# EAGLE board LEDPanel (EAGLE 9.6.2), part 1 of 3
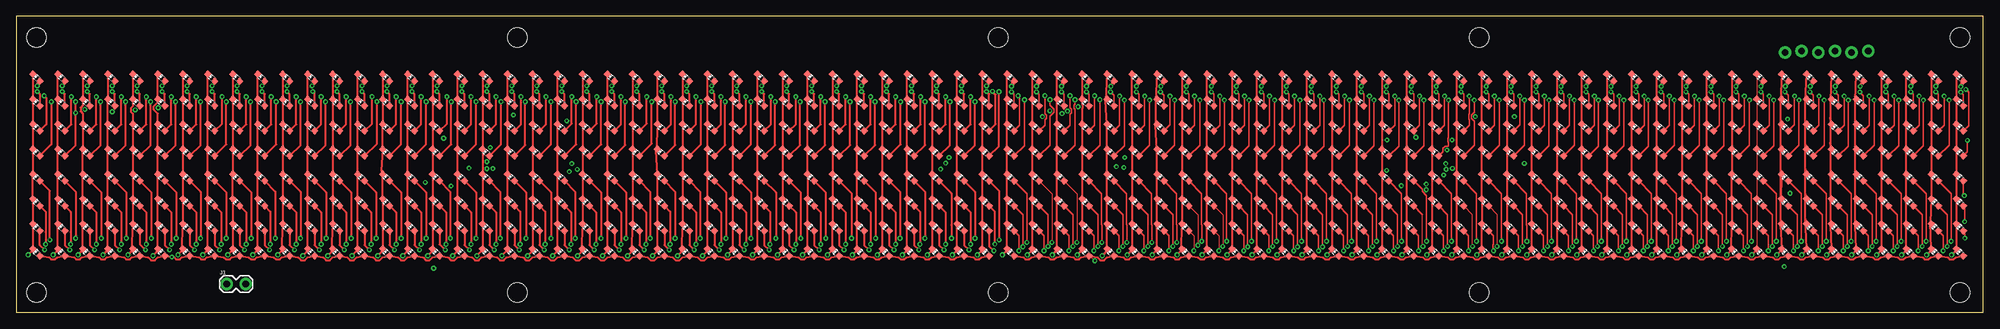
[diagram p2: board, top side]
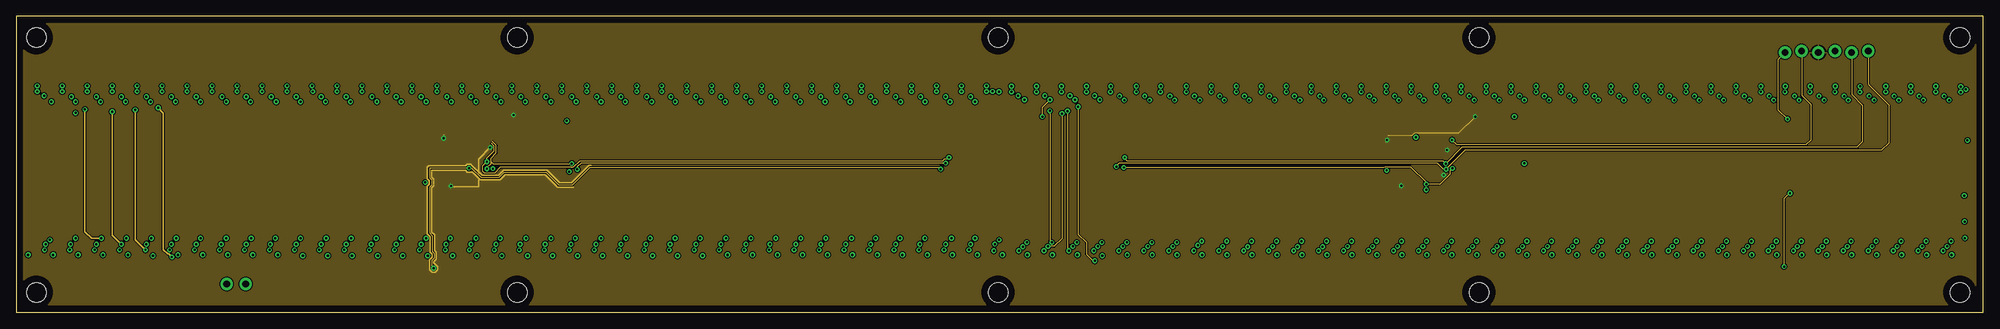
[diagram p3: board, inner layer Route2]
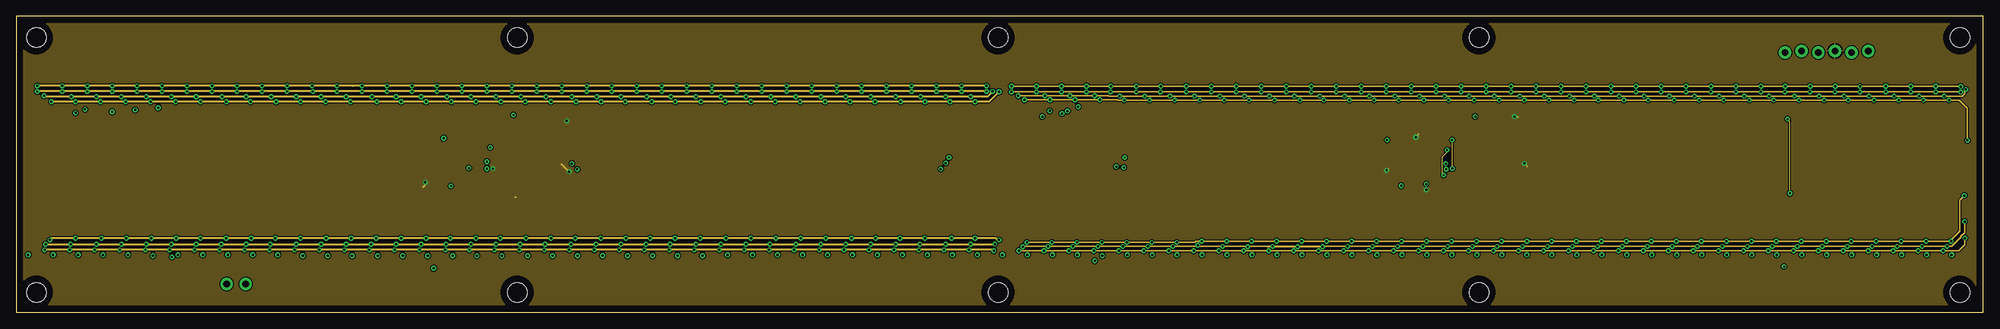
[diagram p4: board, inner layer Route15]
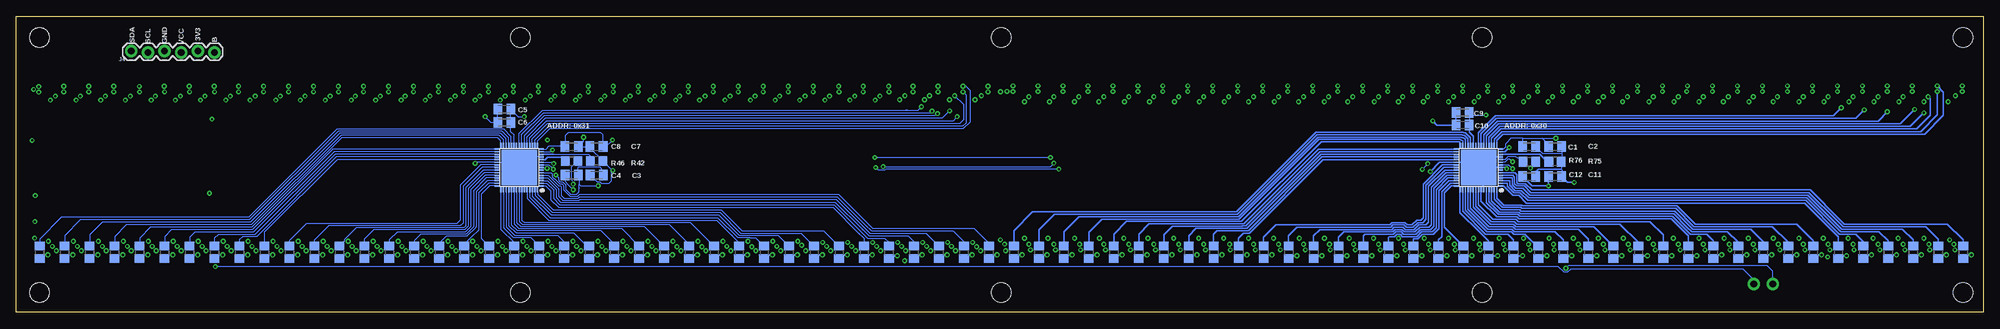
[diagram p5: board, bottom side, seen from below]

Size 299.95 x 45.14 mm. Coordinates in mm from the lower left corner, seen from the top.
Outline: 0,0 299.95,0 299.95,45.14 0,45.14 0,0
Copper layers (1*2+15*16): Top 0.035mm / dielectric 1.5mm / Route2 0.035mm / dielectric 0.15mm / Route15 0.035mm / dielectric 0.2mm / Bottom 0.035mm
Design rules "default *": minimum track width 6mil, minimum drill 0.3mm, track to track 6mil, track to pad 6mil, pad to pad 6mil, via to via 6mil, smd to smd 6mil, copper to edge 40mil, drill to drill 6mil, minimum pad ring 10mil, minimum via ring 8mil, stop-mask expansion 4mil, vias tented up to drill 20mil, thermal gap 10mil
Holes 3 mm at 3.05,41.91 3.05,3.05 296.42,3.05 296.42,41.91 149.73,41.91 149.73,3.05 76.39,3.05 76.39,41.91 223.08,41.91 223.08,3.05

## Footprints (pad centres in the part's own frame; a part is rotated, then mirrored left to right if it is on the bottom)
C0805K = smd 1.3 x 1.6: 1 -1,0; 2 1,0
1X02_LOCK = drill 1.016 pad 1.88: 1 -0.178,0; 2 2.718,0
1X06_LOCK = drill 1.016 pad 1.88: 1 0,0; 2 2.54,-0.254; 3 5.08,0; 4 7.62,-0.254; 5 10.16,0; 6 12.7,-0.254
CHIP-LED0603 = smd 0.8 x 0.8: A 0,-0.75; C 0,0.75
R0805 = smd 1.3 x 1.5: 1 -0.95,0; 2 0.95,0
QFN60 = smd 0.74 x 0.22: 1 -3.375,2.8; 2 -3.375,2.4; 3 -3.375,2; 4 -3.375,1.6; 5 -3.375,1.2; 6 -3.375,0.8; 7 -3.375,0.4; 8 -3.375,0; 9 -3.375,-0.4; 10 -3.375,-0.8; 11 -3.375,-1.2; 12 -3.375,-1.6; 13 -3.375,-2; 14 -3.375,-2.4; 15 -3.375,-2.8; 31 3.375,-2.8; 32 3.375,-2.4; 33 3.375,-2; 34 3.375,-1.6; 35 3.375,-1.2; 36 3.375,-0.8; 37 3.375,-0.4; 38 3.375,0; 39 3.375,0.4; 40 3.375,0.8; 41 3.375,1.2; 42 3.375,1.6; 43 3.375,2; 44 3.375,2.4; 45 3.375,2.8 | smd 0.22 x 0.74: 16 -2.8,-3.375; 17 -2.4,-3.375; 18 -2,-3.375; 19 -1.6,-3.375; 20 -1.2,-3.375; 21 -0.8,-3.375; 22 -0.4,-3.375; 23 0,-3.375; 24 0.4,-3.375; 25 0.8,-3.375; 26 1.2,-3.375; 27 1.6,-3.375; 28 2,-3.375; 29 2.4,-3.375; 30 2.8,-3.375; 46 2.8,3.375; 47 2.4,3.375; 48 2,3.375; 49 1.6,3.375; 50 1.2,3.375; 51 0.8,3.375; 52 0.4,3.375; 53 0,3.375; 54 -0.4,3.375; 55 -0.8,3.375; 56 -1.2,3.375; 57 -1.6,3.375; 58 -2,3.375; 59 -2.4,3.375; 60 -2.8,3.375 | smd 5.4 x 5.4: PAD 0,0

## Placement (x,y rotation side)
C1  0.1uF  [C0805K]  69.22,25.27 0 bottom
C2  1uF  [C0805K]  65.28,25.27 0 bottom
C3  0.1uF  [C0805K]  211.46,20.94 180 bottom
C4  1uF  [C0805K]  215.27,20.94 180 bottom
C5  0.1uF  [C0805K]  225.55,30.99 180 bottom
C6  1uF  [C0805K]  225.55,28.96 180 bottom
C7  0.1uF  [C0805K]  211.47,25.27 180 bottom
C8  1uF  [C0805K]  215.28,25.27 0 bottom
C9  0.1uF  [C0805K]  79.38,30.48 180 bottom
C10  1uF  [C0805K]  79.38,28.58 180 bottom
C11  0.1uF  [C0805K]  65.28,20.7 0 bottom
C12  1uF  [C0805K]  69.22,20.7 0 bottom
J1  [1X02_LOCK]  32.26,4.32 0 top
J4  [1X06_LOCK]  282.45,39.88 0 bottom
LED1  [CHIP-LED0603]  3.05,9.14 45 top
LED2  [CHIP-LED0603]  3.05,12.95 45 top
LED3  [CHIP-LED0603]  3.05,16.76 45 top
LED4  [CHIP-LED0603]  3.05,20.57 45 top
LED5  [CHIP-LED0603]  3.05,24.38 45 top
LED6  [CHIP-LED0603]  3.05,28.19 45 top
LED7  [CHIP-LED0603]  3.05,32 45 top
LED8  [CHIP-LED0603]  3.05,35.81 45 top
LED9  [CHIP-LED0603]  6.86,9.14 45 top
LED10  [CHIP-LED0603]  6.86,12.95 45 top
LED11  [CHIP-LED0603]  6.86,16.76 45 top
LED12  [CHIP-LED0603]  6.86,20.57 45 top
LED13  [CHIP-LED0603]  6.86,24.38 45 top
LED14  [CHIP-LED0603]  6.86,28.19 45 top
LED15  [CHIP-LED0603]  6.86,32 45 top
LED16  [CHIP-LED0603]  6.86,35.81 45 top
LED17  [CHIP-LED0603]  10.67,9.14 45 top
LED18  [CHIP-LED0603]  10.67,12.95 45 top
LED19  [CHIP-LED0603]  10.67,16.76 45 top
LED20  [CHIP-LED0603]  10.67,20.57 45 top
LED21  [CHIP-LED0603]  10.67,24.38 45 top
LED22  [CHIP-LED0603]  10.67,28.19 45 top
LED23  [CHIP-LED0603]  10.67,32 45 top
LED24  [CHIP-LED0603]  10.67,35.81 45 top
LED25  [CHIP-LED0603]  14.48,9.14 45 top
LED26  [CHIP-LED0603]  14.48,12.95 45 top
LED27  [CHIP-LED0603]  14.48,16.76 45 top
LED28  [CHIP-LED0603]  14.48,20.57 45 top
LED29  [CHIP-LED0603]  14.48,24.38 45 top
LED30  [CHIP-LED0603]  14.48,28.19 45 top
LED31  [CHIP-LED0603]  14.48,32 45 top
LED32  [CHIP-LED0603]  14.48,35.81 45 top
LED33  [CHIP-LED0603]  18.29,9.14 45 top
LED34  [CHIP-LED0603]  18.29,12.95 45 top
LED35  [CHIP-LED0603]  18.29,16.76 45 top
LED36  [CHIP-LED0603]  18.29,20.57 45 top
LED37  [CHIP-LED0603]  18.29,24.38 45 top
LED38  [CHIP-LED0603]  18.29,28.19 45 top
LED39  [CHIP-LED0603]  18.29,32 45 top
LED40  [CHIP-LED0603]  18.29,35.81 45 top
LED41  [CHIP-LED0603]  22.1,9.14 45 top
LED42  [CHIP-LED0603]  22.1,12.95 45 top
LED43  [CHIP-LED0603]  22.1,16.76 45 top
LED44  [CHIP-LED0603]  22.1,20.57 45 top
LED45  [CHIP-LED0603]  22.1,24.38 45 top
LED46  [CHIP-LED0603]  22.1,28.19 45 top
LED47  [CHIP-LED0603]  22.1,32 45 top
LED48  [CHIP-LED0603]  22.1,35.81 45 top
LED49  [CHIP-LED0603]  25.91,9.14 45 top
LED50  [CHIP-LED0603]  25.91,12.95 45 top
LED51  [CHIP-LED0603]  25.91,16.76 45 top
LED52  [CHIP-LED0603]  25.91,20.57 45 top
LED53  [CHIP-LED0603]  25.91,24.38 45 top
LED54  [CHIP-LED0603]  25.91,28.19 45 top
LED55  [CHIP-LED0603]  25.91,32 45 top
LED56  [CHIP-LED0603]  25.91,35.81 45 top
LED57  [CHIP-LED0603]  29.72,9.14 45 top
LED58  [CHIP-LED0603]  29.72,12.95 45 top
LED59  [CHIP-LED0603]  29.72,16.76 45 top
LED60  [CHIP-LED0603]  29.72,20.57 45 top
LED61  [CHIP-LED0603]  29.72,24.38 45 top
LED62  [CHIP-LED0603]  29.72,28.19 45 top
LED63  [CHIP-LED0603]  29.72,32 45 top
LED64  [CHIP-LED0603]  29.72,35.81 45 top
LED65  [CHIP-LED0603]  33.53,9.14 45 top
LED66  [CHIP-LED0603]  33.53,12.95 45 top
LED67  [CHIP-LED0603]  33.53,16.76 45 top
LED68  [CHIP-LED0603]  33.53,20.57 45 top
LED69  [CHIP-LED0603]  33.53,24.38 45 top
LED70  [CHIP-LED0603]  33.53,28.19 45 top
LED71  [CHIP-LED0603]  33.53,32 45 top
LED72  [CHIP-LED0603]  33.53,35.81 45 top
LED73  [CHIP-LED0603]  37.34,9.14 45 top
LED74  [CHIP-LED0603]  37.34,12.95 45 top
LED75  [CHIP-LED0603]  37.34,16.76 45 top
LED76  [CHIP-LED0603]  37.34,20.57 45 top
LED77  [CHIP-LED0603]  37.34,24.38 45 top
LED78  [CHIP-LED0603]  37.34,28.19 45 top
LED79  [CHIP-LED0603]  37.34,32 45 top
LED80  [CHIP-LED0603]  37.34,35.81 45 top
LED81  [CHIP-LED0603]  41.15,9.14 45 top
LED82  [CHIP-LED0603]  41.15,12.95 45 top
LED83  [CHIP-LED0603]  41.15,16.76 45 top
LED84  [CHIP-LED0603]  41.15,20.57 45 top
LED85  [CHIP-LED0603]  41.15,24.38 45 top
LED86  [CHIP-LED0603]  41.15,28.19 45 top
LED87  [CHIP-LED0603]  41.15,32 45 top
LED88  [CHIP-LED0603]  41.15,35.81 45 top
LED89  [CHIP-LED0603]  44.96,9.14 45 top
LED90  [CHIP-LED0603]  44.96,12.95 45 top
LED91  [CHIP-LED0603]  44.96,16.76 45 top
LED92  [CHIP-LED0603]  44.96,20.57 45 top
LED93  [CHIP-LED0603]  44.96,24.38 45 top
LED94  [CHIP-LED0603]  44.96,28.19 45 top
LED95  [CHIP-LED0603]  44.96,32 45 top
LED96  [CHIP-LED0603]  44.96,35.81 45 top
LED97  [CHIP-LED0603]  48.77,9.14 45 top
LED98  [CHIP-LED0603]  48.77,12.95 45 top
LED99  [CHIP-LED0603]  48.77,16.76 45 top
LED100  [CHIP-LED0603]  48.77,20.57 45 top
LED101  [CHIP-LED0603]  48.77,24.38 45 top
LED102  [CHIP-LED0603]  48.77,28.19 45 top
LED103  [CHIP-LED0603]  48.77,32 45 top
LED104  [CHIP-LED0603]  48.77,35.81 45 top
LED105  [CHIP-LED0603]  52.58,9.14 45 top
LED106  [CHIP-LED0603]  52.58,12.95 45 top
LED107  [CHIP-LED0603]  52.58,16.76 45 top
LED108  [CHIP-LED0603]  52.58,20.57 45 top
LED109  [CHIP-LED0603]  52.58,24.38 45 top
LED110  [CHIP-LED0603]  52.58,28.19 45 top
LED111  [CHIP-LED0603]  52.58,32 45 top
LED112  [CHIP-LED0603]  52.58,35.81 45 top
LED113  [CHIP-LED0603]  56.39,9.14 45 top
LED114  [CHIP-LED0603]  56.39,12.95 45 top
LED115  [CHIP-LED0603]  56.39,16.76 45 top
LED116  [CHIP-LED0603]  56.39,20.57 45 top
LED117  [CHIP-LED0603]  56.39,24.38 45 top
LED118  [CHIP-LED0603]  56.39,28.19 45 top
LED119  [CHIP-LED0603]  56.39,32 45 top
LED120  [CHIP-LED0603]  56.39,35.81 45 top
LED121  [CHIP-LED0603]  60.2,9.14 45 top
LED122  [CHIP-LED0603]  60.2,12.95 45 top
LED123  [CHIP-LED0603]  60.2,16.76 45 top
LED124  [CHIP-LED0603]  60.2,20.57 45 top
LED125  [CHIP-LED0603]  60.2,24.38 45 top
LED126  [CHIP-LED0603]  60.2,28.19 45 top
LED127  [CHIP-LED0603]  60.2,32 45 top
LED128  [CHIP-LED0603]  60.2,35.81 45 top
LED129  [CHIP-LED0603]  64.01,9.14 45 top
LED130  [CHIP-LED0603]  64.01,12.95 45 top
LED131  [CHIP-LED0603]  64.01,16.76 45 top
LED132  [CHIP-LED0603]  64.01,20.57 45 top
LED133  [CHIP-LED0603]  64.01,24.38 45 top
LED134  [CHIP-LED0603]  64.01,28.19 45 top
LED135  [CHIP-LED0603]  64.01,32 45 top
LED136  [CHIP-LED0603]  64.01,35.81 45 top
LED137  [CHIP-LED0603]  67.82,9.14 45 top
LED138  [CHIP-LED0603]  67.82,12.95 45 top
LED139  [CHIP-LED0603]  67.82,16.76 45 top
LED140  [CHIP-LED0603]  67.82,20.57 45 top
LED141  [CHIP-LED0603]  67.82,24.38 45 top
LED142  [CHIP-LED0603]  67.82,28.19 45 top
LED143  [CHIP-LED0603]  67.82,32 45 top
LED144  [CHIP-LED0603]  67.82,35.81 45 top
LED145  [CHIP-LED0603]  71.63,9.14 45 top
LED146  [CHIP-LED0603]  71.63,12.95 45 top
LED147  [CHIP-LED0603]  71.63,16.76 45 top
LED148  [CHIP-LED0603]  71.63,20.57 45 top
LED149  [CHIP-LED0603]  71.63,24.38 45 top
LED150  [CHIP-LED0603]  71.63,28.19 45 top
LED151  [CHIP-LED0603]  71.63,32 45 top
LED152  [CHIP-LED0603]  71.63,35.81 45 top
LED153  [CHIP-LED0603]  75.44,9.14 45 top
LED154  [CHIP-LED0603]  75.44,12.95 45 top
LED155  [CHIP-LED0603]  75.44,16.76 45 top
LED156  [CHIP-LED0603]  75.44,20.57 45 top
LED157  [CHIP-LED0603]  75.44,24.38 45 top
LED158  [CHIP-LED0603]  75.44,28.19 45 top
LED159  [CHIP-LED0603]  75.44,32 45 top
LED160  [CHIP-LED0603]  75.44,35.81 45 top
LED161  [CHIP-LED0603]  79.25,9.14 45 top
LED162  [CHIP-LED0603]  79.25,12.95 45 top
LED163  [CHIP-LED0603]  79.25,16.76 45 top
LED164  [CHIP-LED0603]  79.25,20.57 45 top
LED165  [CHIP-LED0603]  79.25,24.38 45 top
LED166  [CHIP-LED0603]  79.25,28.19 45 top
LED167  [CHIP-LED0603]  79.25,32 45 top
LED168  [CHIP-LED0603]  79.25,35.81 45 top
LED169  [CHIP-LED0603]  83.06,9.14 45 top
LED170  [CHIP-LED0603]  83.06,12.95 45 top
LED171  [CHIP-LED0603]  83.06,16.76 45 top
LED172  [CHIP-LED0603]  83.06,20.57 45 top
LED173  [CHIP-LED0603]  83.06,24.38 45 top
LED174  [CHIP-LED0603]  83.06,28.19 45 top
LED175  [CHIP-LED0603]  83.06,32 45 top
LED176  [CHIP-LED0603]  83.06,35.81 45 top
LED177  [CHIP-LED0603]  86.87,9.14 45 top
LED178  [CHIP-LED0603]  86.87,12.95 45 top
LED179  [CHIP-LED0603]  86.87,16.76 45 top
LED180  [CHIP-LED0603]  86.87,20.57 45 top
LED181  [CHIP-LED0603]  86.87,24.38 45 top
LED182  [CHIP-LED0603]  86.87,28.19 45 top
LED183  [CHIP-LED0603]  86.87,32 45 top
LED184  [CHIP-LED0603]  86.87,35.81 45 top
LED185  [CHIP-LED0603]  90.68,9.14 45 top
LED186  [CHIP-LED0603]  90.68,12.95 45 top
LED187  [CHIP-LED0603]  90.68,16.76 45 top
LED188  [CHIP-LED0603]  90.68,20.57 45 top
LED189  [CHIP-LED0603]  90.68,24.38 45 top
LED190  [CHIP-LED0603]  90.68,28.19 45 top
LED191  [CHIP-LED0603]  90.68,32 45 top
LED192  [CHIP-LED0603]  90.68,35.81 45 top
LED193  [CHIP-LED0603]  94.49,9.14 45 top
LED194  [CHIP-LED0603]  94.49,12.95 45 top
LED195  [CHIP-LED0603]  94.49,16.76 45 top
LED196  [CHIP-LED0603]  94.49,20.57 45 top
LED197  [CHIP-LED0603]  94.49,24.38 45 top
LED198  [CHIP-LED0603]  94.49,28.19 45 top
LED199  [CHIP-LED0603]  94.49,32 45 top
LED200  [CHIP-LED0603]  94.49,35.81 45 top
LED201  [CHIP-LED0603]  98.3,9.14 45 top
LED202  [CHIP-LED0603]  98.3,12.95 45 top
LED203  [CHIP-LED0603]  98.3,16.76 45 top
LED204  [CHIP-LED0603]  98.3,20.57 45 top
LED205  [CHIP-LED0603]  98.3,24.38 45 top
LED206  [CHIP-LED0603]  98.3,28.19 45 top
LED207  [CHIP-LED0603]  98.3,32 45 top
LED208  [CHIP-LED0603]  98.3,35.81 45 top
LED209  [CHIP-LED0603]  102.11,9.14 45 top
LED210  [CHIP-LED0603]  102.11,12.95 45 top
LED211  [CHIP-LED0603]  102.11,16.76 45 top
LED212  [CHIP-LED0603]  102.11,20.57 45 top
LED213  [CHIP-LED0603]  102.11,24.38 45 top
LED214  [CHIP-LED0603]  102.11,28.19 45 top
LED215  [CHIP-LED0603]  102.11,32 45 top
LED216  [CHIP-LED0603]  102.11,35.81 45 top
LED217  [CHIP-LED0603]  105.92,9.14 45 top
LED218  [CHIP-LED0603]  105.92,12.95 45 top
LED219  [CHIP-LED0603]  105.92,16.76 45 top
LED220  [CHIP-LED0603]  105.92,20.57 45 top
LED221  [CHIP-LED0603]  105.92,24.38 45 top
LED222  [CHIP-LED0603]  105.92,28.19 45 top
LED223  [CHIP-LED0603]  105.92,32 45 top
LED224  [CHIP-LED0603]  105.92,35.81 45 top
LED225  [CHIP-LED0603]  109.73,9.14 45 top
LED226  [CHIP-LED0603]  109.73,12.95 45 top
LED227  [CHIP-LED0603]  109.73,16.76 45 top
LED228  [CHIP-LED0603]  109.73,20.57 45 top
LED229  [CHIP-LED0603]  109.73,24.38 45 top
LED230  [CHIP-LED0603]  109.73,28.19 45 top
LED231  [CHIP-LED0603]  109.73,32 45 top
LED232  [CHIP-LED0603]  109.73,35.81 45 top
LED233  [CHIP-LED0603]  113.54,9.14 45 top
LED234  [CHIP-LED0603]  113.54,12.95 45 top
LED235  [CHIP-LED0603]  113.54,16.76 45 top
LED236  [CHIP-LED0603]  113.54,20.57 45 top
LED237  [CHIP-LED0603]  113.54,24.38 45 top
LED238  [CHIP-LED0603]  113.54,28.19 45 top
LED239  [CHIP-LED0603]  113.54,32 45 top
LED240  [CHIP-LED0603]  113.54,35.81 45 top
LED241  [CHIP-LED0603]  117.35,9.14 45 top
LED242  [CHIP-LED0603]  117.35,12.95 45 top
LED243  [CHIP-LED0603]  117.35,16.76 45 top
LED244  [CHIP-LED0603]  117.35,20.57 45 top
LED245  [CHIP-LED0603]  117.35,24.38 45 top
LED246  [CHIP-LED0603]  117.35,28.19 45 top
LED247  [CHIP-LED0603]  117.35,32 45 top
LED248  [CHIP-LED0603]  117.35,35.81 45 top
LED249  [CHIP-LED0603]  121.16,9.14 45 top
LED250  [CHIP-LED0603]  121.16,12.95 45 top
LED251  [CHIP-LED0603]  121.16,16.76 45 top
LED252  [CHIP-LED0603]  121.16,20.57 45 top
LED253  [CHIP-LED0603]  121.16,24.38 45 top
LED254  [CHIP-LED0603]  121.16,28.19 45 top
LED255  [CHIP-LED0603]  121.16,32 45 top
LED256  [CHIP-LED0603]  121.16,35.81 45 top
LED257  [CHIP-LED0603]  124.97,9.14 45 top
LED258  [CHIP-LED0603]  124.97,12.95 45 top
LED259  [CHIP-LED0603]  124.97,16.76 45 top
LED260  [CHIP-LED0603]  124.97,20.57 45 top
LED261  [CHIP-LED0603]  124.97,24.38 45 top
LED262  [CHIP-LED0603]  124.97,28.19 45 top
LED263  [CHIP-LED0603]  124.97,32 45 top
LED264  [CHIP-LED0603]  124.97,35.81 45 top
LED265  [CHIP-LED0603]  128.78,9.14 45 top
LED266  [CHIP-LED0603]  128.78,12.95 45 top
LED267  [CHIP-LED0603]  128.78,16.76 45 top
LED268  [CHIP-LED0603]  128.78,20.57 45 top
LED269  [CHIP-LED0603]  128.78,24.38 45 top
LED270  [CHIP-LED0603]  128.78,28.19 45 top
LED271  [CHIP-LED0603]  128.78,32 45 top
LED272  [CHIP-LED0603]  128.78,35.81 45 top
LED273  [CHIP-LED0603]  132.59,9.14 45 top
LED274  [CHIP-LED0603]  132.59,12.95 45 top
LED275  [CHIP-LED0603]  132.59,16.76 45 top
LED276  [CHIP-LED0603]  132.59,20.57 45 top
LED277  [CHIP-LED0603]  132.59,24.38 45 top
LED278  [CHIP-LED0603]  132.59,28.19 45 top
LED279  [CHIP-LED0603]  132.59,32 45 top
LED280  [CHIP-LED0603]  132.59,35.81 45 top
LED281  [CHIP-LED0603]  136.4,9.14 45 top
LED282  [CHIP-LED0603]  136.4,12.95 45 top
LED283  [CHIP-LED0603]  136.4,16.76 45 top
LED284  [CHIP-LED0603]  136.4,20.57 45 top
LED285  [CHIP-LED0603]  136.4,24.38 45 top
LED286  [CHIP-LED0603]  136.4,28.19 45 top
LED287  [CHIP-LED0603]  136.4,32 45 top
LED288  [CHIP-LED0603]  136.4,35.81 45 top
LED289  [CHIP-LED0603]  140.21,9.14 45 top
LED290  [CHIP-LED0603]  140.21,12.95 45 top
LED291  [CHIP-LED0603]  140.21,16.76 45 top
LED292  [CHIP-LED0603]  140.21,20.57 45 top
LED293  [CHIP-LED0603]  140.21,24.38 45 top
LED294  [CHIP-LED0603]  140.21,28.19 45 top
LED295  [CHIP-LED0603]  140.21,32 45 top
LED296  [CHIP-LED0603]  140.21,35.81 45 top
LED297  [CHIP-LED0603]  144.02,9.14 45 top
LED298  [CHIP-LED0603]  144.02,12.95 45 top
LED299  [CHIP-LED0603]  144.02,16.76 45 top
LED300  [CHIP-LED0603]  144.02,20.57 45 top
LED301  [CHIP-LED0603]  144.02,24.38 45 top
LED302  [CHIP-LED0603]  144.02,28.19 45 top
LED303  [CHIP-LED0603]  144.02,32 45 top
LED304  [CHIP-LED0603]  144.02,35.81 45 top
LED305  [CHIP-LED0603]  147.83,9.14 45 top
LED306  [CHIP-LED0603]  147.83,12.95 45 top
LED307  [CHIP-LED0603]  147.83,16.76 45 top
LED308  [CHIP-LED0603]  147.83,20.57 45 top
LED309  [CHIP-LED0603]  147.83,24.38 45 top
LED310  [CHIP-LED0603]  147.83,28.19 45 top
LED311  [CHIP-LED0603]  147.83,32 45 top
LED312  [CHIP-LED0603]  147.83,35.81 45 top
LED313  [CHIP-LED0603]  151.64,9.14 45 top
LED314  [CHIP-LED0603]  151.64,12.95 45 top
LED315  [CHIP-LED0603]  151.64,16.76 45 top
LED316  [CHIP-LED0603]  151.64,20.57 45 top
LED317  [CHIP-LED0603]  151.64,24.38 45 top
LED318  [CHIP-LED0603]  151.64,28.19 45 top
LED319  [CHIP-LED0603]  151.64,32 45 top
LED320  [CHIP-LED0603]  151.64,35.81 45 top
LED321  [CHIP-LED0603]  155.45,9.14 45 top
LED322  [CHIP-LED0603]  155.45,12.95 45 top
LED323  [CHIP-LED0603]  155.45,16.76 45 top
LED324  [CHIP-LED0603]  155.45,20.57 45 top
LED325  [CHIP-LED0603]  155.45,24.38 45 top
LED326  [CHIP-LED0603]  155.45,28.19 45 top
LED327  [CHIP-LED0603]  155.45,32 45 top
LED328  [CHIP-LED0603]  155.45,35.81 45 top
LED329  [CHIP-LED0603]  159.26,9.14 45 top
LED330  [CHIP-LED0603]  159.26,12.95 45 top
LED331  [CHIP-LED0603]  159.26,16.76 45 top
LED332  [CHIP-LED0603]  159.26,20.57 45 top
LED333  [CHIP-LED0603]  159.26,24.38 45 top
LED334  [CHIP-LED0603]  159.26,28.19 45 top
LED335  [CHIP-LED0603]  159.26,32 45 top
LED336  [CHIP-LED0603]  159.26,35.81 45 top
LED337  [CHIP-LED0603]  163.07,9.14 45 top
LED338  [CHIP-LED0603]  163.07,12.95 45 top
LED339  [CHIP-LED0603]  163.07,16.76 45 top
LED340  [CHIP-LED0603]  163.07,20.57 45 top
LED341  [CHIP-LED0603]  163.07,24.38 45 top
LED342  [CHIP-LED0603]  163.07,28.19 45 top
LED343  [CHIP-LED0603]  163.07,32 45 top
LED344  [CHIP-LED0603]  163.07,35.81 45 top
LED345  [CHIP-LED0603]  166.88,9.14 45 top
LED346  [CHIP-LED0603]  166.88,12.95 45 top
LED347  [CHIP-LED0603]  166.88,16.76 45 top
LED348  [CHIP-LED0603]  166.88,20.57 45 top
LED349  [CHIP-LED0603]  166.88,24.38 45 top
LED350  [CHIP-LED0603]  166.88,28.19 45 top
LED351  [CHIP-LED0603]  166.88,32 45 top
LED352  [CHIP-LED0603]  166.88,35.81 45 top
LED353  [CHIP-LED0603]  170.69,9.14 45 top
LED354  [CHIP-LED0603]  170.69,12.95 45 top
LED355  [CHIP-LED0603]  170.69,16.76 45 top
LED356  [CHIP-LED0603]  170.69,20.57 45 top
LED357  [CHIP-LED0603]  170.69,24.38 45 top
LED358  [CHIP-LED0603]  170.69,28.19 45 top
LED359  [CHIP-LED0603]  170.69,32 45 top
LED360  [CHIP-LED0603]  170.69,35.81 45 top
LED361  [CHIP-LED0603]  174.5,9.14 45 top
LED362  [CHIP-LED0603]  174.5,12.95 45 top
LED363  [CHIP-LED0603]  174.5,16.76 45 top
LED364  [CHIP-LED0603]  174.5,20.57 45 top
LED365  [CHIP-LED0603]  174.5,24.38 45 top
LED366  [CHIP-LED0603]  174.5,28.19 45 top
LED367  [CHIP-LED0603]  174.5,32 45 top
LED368  [CHIP-LED0603]  174.5,35.81 45 top
LED369  [CHIP-LED0603]  178.31,9.14 45 top
LED370  [CHIP-LED0603]  178.31,12.95 45 top
LED371  [CHIP-LED0603]  178.31,16.76 45 top
LED372  [CHIP-LED0603]  178.31,20.57 45 top
LED373  [CHIP-LED0603]  178.31,24.38 45 top
LED374  [CHIP-LED0603]  178.31,28.19 45 top
LED375  [CHIP-LED0603]  178.31,32 45 top
LED376  [CHIP-LED0603]  178.31,35.81 45 top
LED377  [CHIP-LED0603]  182.12,9.14 45 top
LED378  [CHIP-LED0603]  182.12,12.95 45 top
LED379  [CHIP-LED0603]  182.12,16.76 45 top
LED380  [CHIP-LED0603]  182.12,20.57 45 top
LED381  [CHIP-LED0603]  182.12,24.38 45 top
LED382  [CHIP-LED0603]  182.12,28.19 45 top
LED383  [CHIP-LED0603]  182.12,32 45 top
LED384  [CHIP-LED0603]  182.12,35.81 45 top
LED385  [CHIP-LED0603]  185.93,9.14 45 top
LED386  [CHIP-LED0603]  185.93,12.95 45 top
LED387  [CHIP-LED0603]  185.93,16.76 45 top
LED388  [CHIP-LED0603]  185.93,20.57 45 top
LED389  [CHIP-LED0603]  185.93,24.38 45 top
LED390  [CHIP-LED0603]  185.93,28.19 45 top
LED391  [CHIP-LED0603]  185.93,32 45 top
LED392  [CHIP-LED0603]  185.93,35.81 45 top
LED393  [CHIP-LED0603]  189.74,9.14 45 top
LED394  [CHIP-LED0603]  189.74,12.95 45 top
LED395  [CHIP-LED0603]  189.74,16.76 45 top
LED396  [CHIP-LED0603]  189.74,20.57 45 top
LED397  [CHIP-LED0603]  189.74,24.38 45 top
LED398  [CHIP-LED0603]  189.74,28.19 45 top
LED399  [CHIP-LED0603]  189.74,32 45 top
LED400  [CHIP-LED0603]  189.74,35.81 45 top
LED401  [CHIP-LED0603]  193.55,9.14 45 top
LED402  [CHIP-LED0603]  193.55,12.95 45 top
LED403  [CHIP-LED0603]  193.55,16.76 45 top
LED404  [CHIP-LED0603]  193.55,20.57 45 top
LED405  [CHIP-LED0603]  193.55,24.38 45 top
LED406  [CHIP-LED0603]  193.55,28.19 45 top
LED407  [CHIP-LED0603]  193.55,32 45 top
LED408  [CHIP-LED0603]  193.55,35.81 45 top
LED409  [CHIP-LED0603]  197.36,9.14 45 top
LED410  [CHIP-LED0603]  197.36,12.95 45 top
LED411  [CHIP-LED0603]  197.36,16.76 45 top
LED412  [CHIP-LED0603]  197.36,20.57 45 top
LED413  [CHIP-LED0603]  197.36,24.38 45 top
LED414  [CHIP-LED0603]  197.36,28.19 45 top
LED415  [CHIP-LED0603]  197.36,32 45 top
LED416  [CHIP-LED0603]  197.36,35.81 45 top
LED417  [CHIP-LED0603]  201.17,9.14 45 top
LED418  [CHIP-LED0603]  201.17,12.95 45 top
LED419  [CHIP-LED0603]  201.17,16.76 45 top
LED420  [CHIP-LED0603]  201.17,20.57 45 top
LED421  [CHIP-LED0603]  201.17,24.38 45 top
LED422  [CHIP-LED0603]  201.17,28.19 45 top
LED423  [CHIP-LED0603]  201.17,32 45 top
LED424  [CHIP-LED0603]  201.17,35.81 45 top
LED425  [CHIP-LED0603]  204.98,9.14 45 top
LED426  [CHIP-LED0603]  204.98,12.95 45 top
LED427  [CHIP-LED0603]  204.98,16.76 45 top
LED428  [CHIP-LED0603]  204.98,20.57 45 top
LED429  [CHIP-LED0603]  204.98,24.38 45 top
LED430  [CHIP-LED0603]  204.98,28.19 45 top
LED431  [CHIP-LED0603]  204.98,32 45 top
LED432  [CHIP-LED0603]  204.98,35.81 45 top
LED433  [CHIP-LED0603]  208.79,9.14 45 top
LED434  [CHIP-LED0603]  208.79,12.95 45 top
LED435  [CHIP-LED0603]  208.79,16.76 45 top
LED436  [CHIP-LED0603]  208.79,20.57 45 top
LED437  [CHIP-LED0603]  208.79,24.38 45 top
LED438  [CHIP-LED0603]  208.79,28.19 45 top
LED439  [CHIP-LED0603]  208.79,32 45 top
LED440  [CHIP-LED0603]  208.79,35.81 45 top
LED441  [CHIP-LED0603]  212.6,9.14 45 top
LED442  [CHIP-LED0603]  212.6,12.95 45 top
LED443  [CHIP-LED0603]  212.6,16.76 45 top
LED444  [CHIP-LED0603]  212.6,20.57 45 top
LED445  [CHIP-LED0603]  212.6,24.38 45 top
LED446  [CHIP-LED0603]  212.6,28.19 45 top
LED447  [CHIP-LED0603]  212.6,32 45 top
LED448  [CHIP-LED0603]  212.6,35.81 45 top
LED449  [CHIP-LED0603]  216.41,9.14 45 top
LED450  [CHIP-LED0603]  216.41,12.95 45 top
LED451  [CHIP-LED0603]  216.41,16.76 45 top
LED452  [CHIP-LED0603]  216.41,20.57 45 top
LED453  [CHIP-LED0603]  216.41,24.38 45 top
LED454  [CHIP-LED0603]  216.41,28.19 45 top
LED455  [CHIP-LED0603]  216.41,32 45 top
LED456  [CHIP-LED0603]  216.41,35.81 45 top
LED457  [CHIP-LED0603]  220.22,9.14 45 top
LED458  [CHIP-LED0603]  220.22,12.95 45 top
LED459  [CHIP-LED0603]  220.22,16.76 45 top
LED460  [CHIP-LED0603]  220.22,20.57 45 top
LED461  [CHIP-LED0603]  220.22,24.38 45 top
LED462  [CHIP-LED0603]  220.22,28.19 45 top
LED463  [CHIP-LED0603]  220.22,32 45 top
LED464  [CHIP-LED0603]  220.22,35.81 45 top
LED465  [CHIP-LED0603]  224.03,9.14 45 top
LED466  [CHIP-LED0603]  224.03,12.95 45 top
LED467  [CHIP-LED0603]  224.03,16.76 45 top
LED468  [CHIP-LED0603]  224.03,20.57 45 top
LED469  [CHIP-LED0603]  224.03,24.38 45 top
LED470  [CHIP-LED0603]  224.03,28.19 45 top
LED471  [CHIP-LED0603]  224.03,32 45 top
LED472  [CHIP-LED0603]  224.03,35.81 45 top
LED473  [CHIP-LED0603]  227.84,9.14 45 top
LED474  [CHIP-LED0603]  227.84,12.95 45 top
LED475  [CHIP-LED0603]  227.84,16.76 45 top
LED476  [CHIP-LED0603]  227.84,20.57 45 top
LED477  [CHIP-LED0603]  227.84,24.38 45 top
LED478  [CHIP-LED0603]  227.84,28.19 45 top
LED479  [CHIP-LED0603]  227.84,32 45 top
LED480  [CHIP-LED0603]  227.84,35.81 45 top
LED481  [CHIP-LED0603]  231.65,9.14 45 top
LED482  [CHIP-LED0603]  231.65,12.95 45 top
LED483  [CHIP-LED0603]  231.65,16.76 45 top
LED484  [CHIP-LED0603]  231.65,20.57 45 top
LED485  [CHIP-LED0603]  231.65,24.38 45 top
LED486  [CHIP-LED0603]  231.65,28.19 45 top
LED487  [CHIP-LED0603]  231.65,32 45 top
LED488  [CHIP-LED0603]  231.65,35.81 45 top
LED489  [CHIP-LED0603]  235.46,9.14 45 top
LED490  [CHIP-LED0603]  235.46,12.95 45 top
LED491  [CHIP-LED0603]  235.46,16.76 45 top
LED492  [CHIP-LED0603]  235.46,20.57 45 top
LED493  [CHIP-LED0603]  235.46,24.38 45 top
LED494  [CHIP-LED0603]  235.46,28.19 45 top
LED495  [CHIP-LED0603]  235.46,32 45 top
LED496  [CHIP-LED0603]  235.46,35.81 45 top
LED497  [CHIP-LED0603]  239.27,9.14 45 top
LED498  [CHIP-LED0603]  239.27,12.95 45 top
LED499  [CHIP-LED0603]  239.27,16.76 45 top
LED500  [CHIP-LED0603]  239.27,20.57 45 top
LED501  [CHIP-LED0603]  239.27,24.38 45 top
LED502  [CHIP-LED0603]  239.27,28.19 45 top
LED503  [CHIP-LED0603]  239.27,32 45 top
LED504  [CHIP-LED0603]  239.27,35.81 45 top
LED505  [CHIP-LED0603]  243.08,9.14 45 top
LED506  [CHIP-LED0603]  243.08,12.95 45 top
LED507  [CHIP-LED0603]  243.08,16.76 45 top
LED508  [CHIP-LED0603]  243.08,20.57 45 top
LED509  [CHIP-LED0603]  243.08,24.38 45 top
LED510  [CHIP-LED0603]  243.08,28.19 45 top
LED511  [CHIP-LED0603]  243.08,32 45 top
LED512  [CHIP-LED0603]  243.08,35.81 45 top
LED513  [CHIP-LED0603]  246.89,9.14 45 top
LED514  [CHIP-LED0603]  246.89,12.95 45 top
LED515  [CHIP-LED0603]  246.89,16.76 45 top
LED516  [CHIP-LED0603]  246.89,20.57 45 top
LED517  [CHIP-LED0603]  246.89,24.38 45 top
LED518  [CHIP-LED0603]  246.89,28.19 45 top
LED519  [CHIP-LED0603]  246.89,32 45 top
LED520  [CHIP-LED0603]  246.89,35.81 45 top
LED521  [CHIP-LED0603]  250.7,9.14 45 top
LED522  [CHIP-LED0603]  250.7,12.95 45 top
LED523  [CHIP-LED0603]  250.7,16.76 45 top
LED524  [CHIP-LED0603]  250.7,20.57 45 top
LED525  [CHIP-LED0603]  250.7,24.38 45 top
LED526  [CHIP-LED0603]  250.7,28.19 45 top
LED527  [CHIP-LED0603]  250.7,32 45 top
LED528  [CHIP-LED0603]  250.7,35.81 45 top
LED529  [CHIP-LED0603]  254.51,9.14 45 top
LED530  [CHIP-LED0603]  254.51,12.95 45 top
LED531  [CHIP-LED0603]  254.51,16.76 45 top
LED532  [CHIP-LED0603]  254.51,20.57 45 top
LED533  [CHIP-LED0603]  254.51,24.38 45 top
LED534  [CHIP-LED0603]  254.51,28.19 45 top
LED535  [CHIP-LED0603]  254.51,32 45 top
LED536  [CHIP-LED0603]  254.51,35.81 45 top
LED537  [CHIP-LED0603]  258.32,9.14 45 top
LED538  [CHIP-LED0603]  258.32,12.95 45 top
LED539  [CHIP-LED0603]  258.32,16.76 45 top
LED540  [CHIP-LED0603]  258.32,20.57 45 top
LED541  [CHIP-LED0603]  258.32,24.38 45 top
LED542  [CHIP-LED0603]  258.32,28.19 45 top
LED543  [CHIP-LED0603]  258.32,32 45 top
LED544  [CHIP-LED0603]  258.32,35.81 45 top
LED545  [CHIP-LED0603]  262.13,9.14 45 top
LED546  [CHIP-LED0603]  262.13,12.95 45 top
LED547  [CHIP-LED0603]  262.13,16.76 45 top
LED548  [CHIP-LED0603]  262.13,20.57 45 top
LED549  [CHIP-LED0603]  262.13,24.38 45 top
LED550  [CHIP-LED0603]  262.13,28.19 45 top
LED551  [CHIP-LED0603]  262.13,32 45 top
LED552  [CHIP-LED0603]  262.13,35.81 45 top
LED553  [CHIP-LED0603]  265.94,9.14 45 top
LED554  [CHIP-LED0603]  265.94,12.95 45 top
LED555  [CHIP-LED0603]  265.94,16.76 45 top
LED556  [CHIP-LED0603]  265.94,20.57 45 top
LED557  [CHIP-LED0603]  265.94,24.38 45 top
LED558  [CHIP-LED0603]  265.94,28.19 45 top
LED559  [CHIP-LED0603]  265.94,32 45 top
LED560  [CHIP-LED0603]  265.94,35.81 45 top
LED561  [CHIP-LED0603]  269.75,9.14 45 top
LED562  [CHIP-LED0603]  269.75,12.95 45 top
LED563  [CHIP-LED0603]  269.75,16.76 45 top
LED564  [CHIP-LED0603]  269.75,20.57 45 top
LED565  [CHIP-LED0603]  269.75,24.38 45 top
LED566  [CHIP-LED0603]  269.75,28.19 45 top
LED567  [CHIP-LED0603]  269.75,32 45 top
LED568  [CHIP-LED0603]  269.75,35.81 45 top
LED569  [CHIP-LED0603]  273.56,9.14 45 top
LED570  [CHIP-LED0603]  273.56,12.95 45 top
LED571  [CHIP-LED0603]  273.56,16.76 45 top
LED572  [CHIP-LED0603]  273.56,20.57 45 top
LED573  [CHIP-LED0603]  273.56,24.38 45 top
LED574  [CHIP-LED0603]  273.56,28.19 45 top
LED575  [CHIP-LED0603]  273.56,32 45 top
LED576  [CHIP-LED0603]  273.56,35.81 45 top
LED577  [CHIP-LED0603]  277.37,9.14 45 top
LED578  [CHIP-LED0603]  277.37,12.95 45 top
LED579  [CHIP-LED0603]  277.37,16.76 45 top
LED580  [CHIP-LED0603]  277.37,20.57 45 top
LED581  [CHIP-LED0603]  277.37,24.38 45 top
LED582  [CHIP-LED0603]  277.37,28.19 45 top
LED583  [CHIP-LED0603]  277.37,32 45 top
LED584  [CHIP-LED0603]  277.37,35.81 45 top
LED585  [CHIP-LED0603]  281.18,9.14 45 top
LED586  [CHIP-LED0603]  281.18,12.95 45 top
LED587  [CHIP-LED0603]  281.18,16.76 45 top
LED588  [CHIP-LED0603]  281.18,20.57 45 top
LED589  [CHIP-LED0603]  281.18,24.38 45 top
LED590  [CHIP-LED0603]  281.18,28.19 45 top
LED591  [CHIP-LED0603]  281.18,32 45 top
LED592  [CHIP-LED0603]  281.18,35.81 45 top
LED593  [CHIP-LED0603]  284.99,9.14 45 top
LED594  [CHIP-LED0603]  284.99,12.95 45 top
LED595  [CHIP-LED0603]  284.99,16.76 45 top
LED596  [CHIP-LED0603]  284.99,20.57 45 top
LED597  [CHIP-LED0603]  284.99,24.38 45 top
LED598  [CHIP-LED0603]  284.99,28.19 45 top
LED599  [CHIP-LED0603]  284.99,32 45 top
LED600  [CHIP-LED0603]  284.99,35.81 45 top
LED601  [CHIP-LED0603]  288.8,9.14 45 top
LED602  [CHIP-LED0603]  288.8,12.95 45 top
LED603  [CHIP-LED0603]  288.8,16.76 45 top
LED604  [CHIP-LED0603]  288.8,20.57 45 top
LED605  [CHIP-LED0603]  288.8,24.38 45 top
LED606  [CHIP-LED0603]  288.8,28.19 45 top
LED607  [CHIP-LED0603]  288.8,32 45 top
LED608  [CHIP-LED0603]  288.8,35.81 45 top
LED609  [CHIP-LED0603]  292.61,9.14 45 top
LED610  [CHIP-LED0603]  292.61,12.95 45 top
LED611  [CHIP-LED0603]  292.61,16.76 45 top
LED612  [CHIP-LED0603]  292.61,20.57 45 top
LED613  [CHIP-LED0603]  292.61,24.38 45 top
LED614  [CHIP-LED0603]  292.61,28.19 45 top
LED615  [CHIP-LED0603]  292.61,32 45 top
LED616  [CHIP-LED0603]  292.61,35.81 45 top
LED617  [CHIP-LED0603]  296.42,9.14 45 top
LED618  [CHIP-LED0603]  296.42,12.95 45 top
LED619  [CHIP-LED0603]  296.42,16.76 45 top
LED620  [CHIP-LED0603]  296.42,20.57 45 top
LED621  [CHIP-LED0603]  296.42,24.38 45 top
LED622  [CHIP-LED0603]  296.42,28.19 45 top
LED623  [CHIP-LED0603]  296.42,32 45 top
LED624  [CHIP-LED0603]  296.42,35.81 45 top
R1  68  [R0805]  292.61,9.14 270 bottom
R2  68  [R0805]  288.8,9.14 270 bottom
R3  68  [R0805]  284.99,9.14 270 bottom
R4  68  [R0805]  163.07,9.14 270 bottom
R5  68  [R0805]  166.88,9.14 270 bottom
R6  68  [R0805]  170.69,9.14 270 bottom
R7  68  [R0805]  174.5,9.14 270 bottom
R8  68  [R0805]  178.31,9.14 270 bottom
R9  68  [R0805]  182.12,9.14 270 bottom
R10  68  [R0805]  185.93,9.14 270 bottom
R11  68  [R0805]  189.74,9.14 270 bottom
R12  68  [R0805]  193.55,9.14 270 bottom
R13  68  [R0805]  197.36,9.14 270 bottom
R14  68  [R0805]  201.17,9.14 270 bottom
R15  68  [R0805]  204.98,9.14 270 bottom
R16  68  [R0805]  208.79,9.14 270 bottom
R17  68  [R0805]  212.6,9.14 270 bottom
R18  68  [R0805]  216.41,9.14 270 bottom
R19  68  [R0805]  220.22,9.14 270 bottom
R20  68  [R0805]  224.03,9.14 270 bottom
R21  68  [R0805]  227.84,9.14 270 bottom
R22  68  [R0805]  296.42,9.14 270 bottom
R23  68  [R0805]  281.18,9.14 270 bottom
R24  68  [R0805]  277.37,9.14 270 bottom
R25  68  [R0805]  273.56,9.14 270 bottom
R26  68  [R0805]  269.75,9.14 270 bottom
R27  68  [R0805]  265.94,9.14 270 bottom
R28  68  [R0805]  262.13,9.14 270 bottom
R29  68  [R0805]  258.32,9.14 270 bottom
R30  68  [R0805]  254.51,9.14 270 bottom
R31  68  [R0805]  250.7,9.14 270 bottom
R32  68  [R0805]  246.89,9.14 270 bottom
R33  68  [R0805]  243.08,9.14 270 bottom
R34  68  [R0805]  239.27,9.14 270 bottom
R35  68  [R0805]  235.46,9.14 270 bottom
R36  68  [R0805]  231.65,9.14 270 bottom
R37  68  [R0805]  14.48,9.14 270 bottom
R38  68  [R0805]  18.29,9.14 270 bottom
R39  68  [R0805]  22.1,9.14 270 bottom
R40  68  [R0805]  25.91,9.14 270 bottom
R41  68  [R0805]  29.72,9.14 270 bottom
R42  10k  [R0805]  211.46,23.1 180 bottom
R43  68  [R0805]  33.53,9.14 270 bottom
R44  68  [R0805]  37.34,9.14 270 bottom
R45  68  [R0805]  41.15,9.14 270 bottom
R46  10k  [R0805]  215.27,23.1 0 bottom
R47  68  [R0805]  44.96,9.14 270 bottom
R48  68  [R0805]  48.77,9.14 270 bottom
R49  68  [R0805]  52.58,9.14 270 bottom
R50  68  [R0805]  56.39,9.14 270 bottom
R51  68  [R0805]  60.2,9.14 270 bottom
R52  68  [R0805]  64.01,9.14 270 bottom
R53  68  [R0805]  67.82,9.14 270 bottom
R54  68  [R0805]  71.63,9.14 270 bottom
R55  68  [R0805]  75.44,9.14 270 bottom
R56  68  [R0805]  79.25,9.14 270 bottom
R57  68  [R0805]  147.83,9.14 270 bottom
R58  68  [R0805]  144.02,9.14 270 bottom
R59  68  [R0805]  140.21,9.14 270 bottom
R60  68  [R0805]  136.4,9.14 270 bottom
R61  68  [R0805]  132.59,9.14 270 bottom
R62  68  [R0805]  128.78,9.14 270 bottom
R63  68  [R0805]  124.97,9.14 270 bottom
R64  68  [R0805]  121.16,9.14 270 bottom
R65  68  [R0805]  117.35,9.14 270 bottom
R66  68  [R0805]  113.54,9.14 270 bottom
R67  68  [R0805]  109.73,9.14 270 bottom
R68  68  [R0805]  105.92,9.14 270 bottom
R69  68  [R0805]  102.11,9.14 270 bottom
R70  68  [R0805]  98.3,9.14 270 bottom
R71  68  [R0805]  94.49,9.14 270 bottom
R72  68  [R0805]  90.68,9.14 270 bottom
R73  68  [R0805]  86.87,9.14 270 bottom
R74  68  [R0805]  83.06,9.14 270 bottom
R75  10k  [R0805]  65.28,22.99 180 bottom
R76  10k  [R0805]  69.22,22.99 0 bottom
R77  68  [R0805]  151.64,9.14 270 bottom
R78  68  [R0805]  155.45,9.14 270 bottom
R79  68  [R0805]  159.26,9.14 270 bottom
R80  68  [R0805]  3.05,9.14 270 bottom
R81  68  [R0805]  6.86,9.14 270 bottom
R82  68  [R0805]  10.67,9.14 270 bottom
U1  IS31FL3741_QFN60  [QFN60]  223.27,22.1 180 bottom
U2  IS31FL3741_QFN60  [QFN60]  76.96,22.1 180 bottom

## Tracks (layer width: path | path; a pad name or v marks a point on that pad's centre or on a via)
3V3  (via drill 0.3)
  Route2 0.152: v219.02,21.97 218.64,21.6 218.64,21.09 217.1,19.56 v215.01,19.56 215.01,19.81 212.58,22.24 208.74,22.24 208.6,22.1 v168.91,22.1 | v140.97,21.84 140.72,22.1 87.5,22.1 84.84,19.43 82.68,19.43 80.77,21.34 74.42,21.34 73.66,20.57 70.87,20.57 69.43,22.01 v69.03,22.01 63.03,22.01 62.99,21.97 62.99,20.5 63.29,20.2 63.29,19.42 62.99,19.12 62.99,12.12 63.42,11.69 63.42,9.31 63.7,9.04 63.7,8.24 63.34,7.88 63.34,7.01 v63.63,6.73 63.75,6.6 63.82,6.67 63.75,6.73 | J4.5 272.29,33.15 273.69,31.75 273.69,26.29 272.92,25.53 219.71,25.53 v218.95,26.29
  Route15 0.152: v218.95,26.29 218.95,22.04 v219.02,21.97
  Bottom 0.152: R76.2 68.27,22.77 v69.03,22.01 | U1.8 219.83,22.04 219.43,22.04 219.36,21.97 v219.02,21.97 | v215.01,19.56 215.01,19.91 215.14,20.05 | 215.14,20.07 215.14,20.05 | 215.14,20.05 215.27,20.17 215.27,22.21 214.38,23.1 | v140.97,21.84 167.32,21.84 167.53,21.64 168.46,21.64 v168.91,22.1 | J1.1 32.08,6.3 32.89,7.11 63.25,7.11 v63.63,6.73
  Bottom 0.203: 214.77,23.1 214.38,23.1 R46.2
BUTTON  (via drill 0.3)
  Route2 0.152: v269.62,6.98 269.62,17.4 270.38,18.16 v270.51,18.16 | v270.13,29.46 268.73,30.86 268.73,38.61 J4.6
  Route15 0.152: v270.51,18.16 270.51,29.08 v270.13,29.46
  Bottom 0.152: J1.2 34.98,5 36.58,6.6 62.87,6.6 63.37,6.1 63.88,6.1 64.77,6.98 v269.62,6.98
GND  (via drill 0.3)
  Route15 0.152: v228.47,29.84 228.98,29.84 229.11,29.72 | v213.45,26.71 213.45,26.76 213.87,27.18 213.8,27.24 213.36,26.8 | v230,22.73 230.38,22.35 230.38,22.1 | v208.98,21.66 209.3,21.97 | v215.01,18.7 215.01,18.41 215.14,18.29
  Route15 0.203: 76.2,17.53 76.07,17.53 76.07,17.65 | v84.33,21.47 83.19,22.61 83.06,22.61 | v62.36,19.81 62.36,19.36 62.05,19.05
  Bottom 0.152: C1.2 67.19,24.24 64.27,24.24 64.26,24.26 | 64.26,24.26 64.26,25.26 C2.2 | 64.26,24.26 64.26,23.05 R75.1 | C5.2 C6.2 227.58,28.96 v228.47,29.84 | v213.45,26.71 213.45,26.1 C8.2 C7.2 212.47,25.06 R42.1 209.06,21.66 v208.98,21.66 209.23,21.41 209.23,20 | U1.12 222.43,23.7 222.95,23.18 | U1.PAD 223.27,21.59 224.03,20.83 224.03,22.1 223.65,22.48 | 222.95,23.18 223.65,22.48 | U1.55 222.47,21.17 223.65,22.35 223.65,22.48 | v230,22.73 229.83,22.9 U1.36 223.23,22.9 222.95,23.18 | 209.23,20 209.55,19.69 210.76,19.69 210.96,19.89 211.4,19.89 C3.2 | 209.23,20 209.17,20.07 | C4.2 216.27,19.97 215.85,19.56 215.85,19.54 v215.01,18.7 | 64.28,22.94 64.28,21.95 64.39,21.84 64.27,21.73 C11.2
  Bottom 0.203: U2.12 77.47,23.7 77.47,22.1 U2.PAD 76.71,22.1 | 76.33,22.1 U2.8 73.08,22.1 72.85,22.1 v72.67,21.92 | 76.33,22.1 76.71,22.1 | U2.55 76.2,18.72 76.2,19.35 76.33,19.35 76.33,22.1 | 212.68,25.27 C7.2 | 76.71,22.1 77.6,22.1 78.4,22.9 U2.36 82.9,22.9 v84.33,21.47 | v83.95,29.21 83.31,28.58 C10.2 C9.2 | C11.2 63.39,19.81 v62.36,19.81 | C12.2 68.22,21.45 67.82,21.84 64.39,21.84 | 64.28,22.94 R75.1
  pour Route15: 0,0 300.23,0 300.23,45.09 0,45.09
N$1
  Bottom 0.203: U2.26 78.16,26.6 78.8,27.24 | 78.99,27.43 78.8,27.24 | 78.8,27.24 78.99,27.43 | 78.8,27.24 78.99,27.43 | 78.99,27.43 79.27,27.43 79.29,27.46 101.75,27.46 113.89,15.32 144.96,15.32 147.83,12.45 R57.1
N$2
  Bottom 0.203: U2.27 78.56,26.49 79.12,27.05 79.39,27.05 79.44,27.1 101.59,27.1 113.73,14.96 141.63,14.96 144.02,12.57 R58.1
N$3
  Bottom 0.203: U2.28 78.96,26.38 79.25,26.67 79.51,26.67 79.59,26.75 101.44,26.75 113.11,15.07 | 113.5,14.69 113.11,15.07 | 113.11,15.07 113.58,14.61 137.92,14.61 140.21,12.32 R59.1
N$4
  Bottom 0.203: U2.29 79.36,26.15 79.5,26.29 79.63,26.29 79.74,26.39 101.29,26.39 113.46,14.22 134.37,14.22 136.4,12.19 R60.1
N$5
  Bottom 0.203: U2.30 79.76,25.91 79.88,26.03 100.94,26.03 113.08,13.89 | 113.29,13.89 113.08,13.89 | R61.1 132.59,11.94 130.66,13.87 113.31,13.87 113.29,13.89 | 113.08,13.89 113.29,13.89
N$6
  Bottom 0.203: U2.31 101.4,24.9 112.76,13.54 113.14,13.54 113.17,13.51 127.2,13.51 128.78,11.94 R62.1
N$7
  Bottom 0.203: U2.32 101.15,24.5 112.47,13.18 112.99,13.18 113.02,13.16 123.62,13.16 124.97,11.81 R63.1
N$8
  Bottom 0.203: U2.33 100.98,24.1 112.28,12.8 | 112.33,12.8 112.28,12.8 | 112.28,12.8 112.31,12.83 112.84,12.83 112.87,12.8 120.04,12.8 121.16,11.68 R64.1
N$9
  Bottom 0.203: U2.34 100.82,23.7 112.07,12.45 116.84,12.45 117.35,11.94 R65.1
N$10
  Bottom 0.203: U2.35 100.65,23.3 111.89,12.06 112.78,12.06 113.54,11.3 R66.1
N$11
  Bottom 0.203: U2.37 82.44,22.5 85.37,19.57 85.37,14.99 | 85.37,14.99 85.37,14.86 | 85.37,14.99 85.37,14.4 85.73,14.04 86.38,14.04 87.08,13.34 87.81,13.34 88.17,13.69 90.14,13.69 90.5,13.34 107.82,13.34 109.73,11.43 R67.1
N$12
  Bottom 0.203: U2.38 82.27,22.1 84.97,19.4 84.97,14.99 | 84.97,14.99 84.97,14.86 | 84.97,14.99 84.97,14.19 85.47,13.69 86.23,13.69 86.94,12.98 87.96,12.98 88.31,13.33 90,13.33 90.35,12.98 104.62,12.98 105.92,11.68 R68.1
N$13
  Bottom 0.203: U2.39 82.11,21.7 84.57,19.24 84.57,14.99 | 84.57,14.99 84.57,14.86 | 84.57,14.99 84.57,13.73 84.97,13.33 86.08,13.33 86.79,12.62 88.11,12.62 88.46,12.98 89.85,12.98 90.2,12.62 101.17,12.62 102.11,11.68 R69.1
N$14
  Bottom 0.203: U2.40 81.94,21.3 84.17,19.07 84.17,14.99 | 84.17,14.99 84.17,14.86 | 84.17,14.99 84.17,13.37 84.56,12.98 85.93,12.98 86.64,12.27 88.25,12.27 88.61,12.62 89.7,12.62 90.05,12.27 97.46,12.27 98.3,11.43 R70.1
N$15
  Bottom 0.203: U2.41 81.78,20.9 83.77,18.91 83.77,14.99 | 83.77,14.99 83.77,14.86 | 83.77,14.99 83.77,13.13 84.28,12.62 85.79,12.62 86.5,11.91 88.4,11.91 88.75,12.27 89.55,12.27 89.91,11.91 94.26,11.91 94.49,11.68 R71.1
N$16
  Bottom 0.203: U2.42 81.61,20.5 83.37,18.74 83.37,12.9 84,12.27 85.64,12.27 86.35,11.56 88.55,11.56 88.9,11.91 89.41,11.91 89.76,11.56 90.55,11.56 90.68,11.43 R72.1
N$17
  Bottom 0.203: U2.43 81.45,20.1 82.97,18.57 82.97,14.99 | 82.97,14.99 82.97,14.86 | 82.97,14.99 82.97,12.79 83.85,11.91 85.49,11.91 86.2,11.2 86.87,11.2 R73.1
N$18
  Bottom 0.203: U2.44 81.28,19.7 82.57,18.41 82.57,14.99 | 82.57,14.99 82.57,14.86 | 82.57,14.99 82.57,11.54 83.06,11.05 R74.1
N$19
  Bottom 0.203: U2.45 81.11,19.3 82.17,18.24 82.17,14.99 | 82.17,14.99 82.17,14.86 | 82.17,14.99 82.17,13.02 R56.1
N$20
  Bottom 0.203: 76.85,12.31 79.76,15.22 U2.46 | 76.85,12.31 76.66,12.12 | 76.85,12.31 75.44,10.9 R55.1
N$21
  Bottom 0.203: U2.47 79.36,15.39 75.88,11.91 72.49,11.91 71.63,11.05 R54.1
N$22
  Bottom 0.203: 76.28,12.87 78.96,15.55 U2.48 | 76.28,12.87 76.09,12.68 | 76.28,12.87 75.67,12.27 71.96,12.27 71.6,11.91 69.85,11.91 68.04,10.09 R53.1
N$23
  Bottom 0.203: 76,13.16 78.56,15.72 U2.49 | 76,13.16 75.81,12.97 | 76,13.16 75.54,12.7 71.88,12.7 71.5,12.32 65.28,12.32 64.01,11.05 R52.1
N$24
  Bottom 0.203: U2.50 78.16,15.89 75.36,13.08 71.75,13.08 71.37,12.7 61.72,12.7 60.2,11.18 R51.1
N$25
  Bottom 0.203: U2.51 77.76,16.05 75.17,13.46 71.63,13.46 71.25,13.08 59.38,13.08 R50.1
N$26
  Bottom 0.203: U2.52 77.36,16.22 74.96,13.82 | 74.96,13.82 | 74.96,13.82 74.94,13.84 71.63,13.84 71.5,13.84 71.12,13.46 55.37,13.46 52.58,10.67 R49.1
N$27
  Bottom 0.203: U2.53 76.96,16.38 74.87,14.29 | 74.87,14.29 74.78,14.2 74.68,14.2 | 74.87,14.29 74.8,14.22 71.25,14.22 70.87,13.84 50.8,13.84 48.77,11.81 R48.1
N$28
  Bottom 0.203: U2.54 76.56,16.96 74.18,14.58 71.1,14.58 70.78,14.26 47.53,14.26 44.96,11.68 R47.1
N$29
  Bottom 0.203: U2.56 75.76,16.73 73.97,14.94 70.95,14.94 70.67,14.66 47.36,14.66 44.65,11.94 42.16,11.94 41.15,10.92 R45.1
N$30
  Bottom 0.203: U2.57 75.36,16.9 73.76,15.29 70.81,15.29 70.57,15.06 47.2,15.06 45.15,13.01 | 45.15,13.01 45.03,12.88 | 45.15,13.01 44.46,12.32 38.99,12.32 37.34,10.67 R44.1
N$31
  Bottom 0.203: U2.58 74.96,17.06 73.55,15.65 70.66,15.65 70.47,15.46 47.03,15.46 44.87,13.29 | 44.87,13.29 44.74,13.17 | 44.87,13.29 44.28,12.7 35.43,12.7 33.53,10.79 R43.1
N$32
  Bottom 0.203: U2.59 74.56,17.23 73.34,16 70.51,16 70.36,15.86 46.87,15.86 44.09,13.08 32.13,13.08 29.72,10.67 R41.1
N$33
  Bottom 0.203: U2.60 74.16,17.39 73.13,16.36 70.36,16.36 70.26,16.26 46.7,16.26 44.31,13.86 | 44.18,13.73 44.31,13.86 | 44.31,13.86 43.91,13.46 28.45,13.46 25.91,10.92 R40.1
N$34
  Bottom 0.203: U2.1 73.14,19.3 71.71,17.87 70.83,17.87 69.63,16.67 27.21,16.67 22.1,11.56 R39.1
N$35
  Bottom 0.203: U2.2 72.54,19.7 72.54,19.21 71.56,18.23 70.62,18.23 69.46,17.07 27.04,17.07 21.91,11.94 19.43,11.94 18.29,10.79 R38.1
N$36
  Bottom 0.203: U2.3 72.19,20.1 72.19,19.35 71.41,18.58 70.41,18.58 69.3,17.47 26.88,17.47 21.73,12.32 15.88,12.32 14.48,10.92 R37.1
N$37
  Bottom 0.203: R75.2 66.48,22.99 67.62,24.13 73.56,24.13 U2.13
N$38
  Bottom 0.152: R76.1 70.67,23.49 70.99,23.49 71.25,23.75 72.52,23.75 72.97,23.3 U2.11
  Bottom 0.203: 70.48,23.3 R76.1
N$39
  Bottom 0.203: U2.4 71.83,20.5 71.83,19.5 71.27,18.94 70.2,18.94 69.13,17.87 26.71,17.87 21.54,12.7 12.32,12.7 10.67,11.05 R82.1
N$40
  Bottom 0.203: 22.24,13.96 26.55,18.27 68.97,18.27 69.99,19.29 71.12,19.29 71.48,19.65 71.48,20.65 71.73,20.9 U2.5 | 22.24,13.96 21.86,13.58 | 22.24,13.96 21.36,13.08 8.76,13.08 6.86,11.18 R81.1
N$41
  Bottom 0.203: U2.6 71.43,21.3 71.12,20.99 71.12,19.8 70.97,19.65 69.78,19.65 68.8,18.67 26.38,18.67 21.95,14.24 | 21.95,14.24 21.57,13.86 | 21.95,14.24 21.17,13.46 5.46,13.46 3.05,11.05 R80.1
N$42
  Bottom 0.152: U1.26 224.47,26.81 225.58,27.93 251.09,27.93 264.54,14.48 293.12,14.48 296.42,11.18 R22.1
N$43
  Bottom 0.203: U1.11 219.35,23.3 218.97,23.68 216.8,23.68 R46.1
N$44
  Bottom 0.152: 217.99,24.1 212.69,24.1 212.41,23.81 R42.2
  Bottom 0.203: 217.99,24.1 U1.13
N$45
  Bottom 0.152: U1.27 224.87,26.65 225.84,27.62 250.89,27.62 264.41,14.1 290.19,14.1 292.61,11.68 R1.1
N$46
  Bottom 0.152: U1.28 225.27,26.48 226.1,27.32 250.69,27.32 264.29,13.72 286.89,13.72 288.8,11.81 R2.1
N$47
  Bottom 0.152: U1.29 225.67,26.31 226.37,27.01 250.43,27.01 264.11,13.34 283.21,13.34 284.99,11.56 R3.1
N$48
  Bottom 0.152: U1.30 226.07,26.15 226.59,26.67 250.34,26.67 264.06,12.95 279.53,12.95 281.18,11.3 R23.1
N$49
  Bottom 0.152: U1.31 251.69,24.9 264.01,12.57 276.35,12.57 277.37,11.56 R24.1
N$50
  Bottom 0.152: U1.32 251.52,24.5 263.82,12.19 272.8,12.19 273.56,11.43 R25.1
N$51
  Bottom 0.152: U1.33 251.35,24.1 263.59,11.86 269.19,11.86 269.75,11.3 R26.1
N$52
  Bottom 0.152: U1.34 251.19,23.7 263.33,11.56 265.43,11.56 265.94,11.05 R27.1
N$53
  Bottom 0.152: R28.1 262.13,12.19 251,23.31 229.76,23.31 229.74,23.3 U1.35
N$54
  Bottom 0.152: U1.37 229.12,22.5 232.25,19.37 232.25,14.05 232.78,13.51 255.75,13.51 258.32,10.95 R29.1
N$55
  Bottom 0.152: U1.38 228.96,22.1 231.85,19.21 231.85,13.62 232.26,13.21 252.32,13.21 254.51,11.02 R30.1
N$56
  Bottom 0.152: U1.39 228.79,21.7 231.45,19.04 231.45,13.15 231.72,12.88 248.16,12.88 249.94,11.09 249.94,10.85 R31.1
N$57
  Bottom 0.152: U1.40 228.63,21.3 231.05,18.88 231.05,13.12 | 231.08,13.08 231.05,13.12 | 231.05,13.12 231.59,12.57 245.44,12.57 246.89,11.12 R32.1
N$58
  Bottom 0.152: U1.41 228.46,20.9 230.65,18.71 230.65,13.09 231.49,12.24 241.91,12.24 243.08,11.07 R33.1
N$59
  Bottom 0.152: U1.42 228.3,20.5 230.25,18.55 230.25,13.06 | 230.25,13.06 230.25,13.05 | 230.25,13.06 231.39,11.91 238.3,11.91 239.27,10.95 R34.1
N$60
  Bottom 0.152: U1.43 228.13,20.1 229.85,18.38 229.85,13.06 | 229.85,13.06 229.85,13.05 | 229.85,13.06 229.94,12.96 229.94,12.92 231.26,11.61 234.42,11.61 235.46,10.57 R35.1
N$61
  Bottom 0.152: U1.44 227.96,19.7 229.45,18.21 229.45,12.56 230.58,11.43 230.62,11.43 231.65,10.41 R36.1
N$62
  Bottom 0.152: U1.45 227.8,19.3 229.05,18.05 229.05,11.3 R21.1
N$63
  Bottom 0.152: U1.46 226.07,12.71 224.03,10.68 R20.1
N$64
  Bottom 0.152: U1.47 225.67,12.88 224.22,11.43 222.45,11.43 222.44,11.43 221.55,11.43 R19.1
N$65
  Bottom 0.152: U1.48 225.27,13.04 223.96,11.74 222.32,11.74 222.32,11.73 217.4,11.73 216.41,10.74 R18.1
N$66
  Bottom 0.152: U1.49 224.87,13.21 223.77,12.12 214.94,12.12 212.91,10.09 R17.1
N$67
  Bottom 0.152: U1.50 224.47,13.38 223.59,12.5 210.84,12.5 208.79,10.44 R16.1
N$68
  Bottom 0.152: U1.51 224.07,13.54 223.33,12.8 207.69,12.8 R15.1
N$69
  Bottom 0.152: U1.52 223.67,13.71 223.08,13.12 204.19,13.12 R14.1
N$70
  Bottom 0.152: U1.53 223.27,13.87 222.82,13.42 | 222.79,13.42 222.82,13.42 | 222.82,13.42 200.42,13.42 197.36,10.36 R13.1
N$71
  Bottom 0.152: U1.54 222.87,14.04 222.56,13.73 197.18,13.73 R12.1
N$72
  Bottom 0.152: U1.56 222.07,17.38 218.75,14.07 193.17,14.07 191.1,12 | 191.1,12 190.83,11.73 | 191.1,12 189.74,10.64 R11.1
N$73
  Bottom 0.152: U1.57 221.67,17.55 218.59,14.47 193,14.47 189.96,11.43 188.16,11.43 188.1,11.38 187.21,11.38 R10.1
N$74
  Bottom 0.152: U1.58 221.27,17.72 218.42,14.87 192.84,14.87 189.72,11.76 183.78,11.76 R9.1
N$75
  Bottom 0.152: U1.59 220.87,17.88 218.25,15.27 192.67,15.27 189.49,12.09 180.3,12.09 R8.1
N$76
  Bottom 0.152: U1.60 220.47,18.05 218.09,15.67 192.5,15.67 189.97,13.13 | 189.97,13.13 189.7,12.87 | 189.97,13.13 189.25,12.42 176.82,12.42 R7.1
N$77
  Bottom 0.152: U1.1 219.22,19.3 218.44,18.52 218.44,17.21 217.27,16.03 175.42,16.03 171.64,12.26 | 171.64,12.26 171.45,12.06 | 171.64,12.26 170.69,11.3 R6.1
N$78
  Bottom 0.152: U1.2 219.05,19.7 218.04,18.69 218.04,17.37 217.1,16.43 175.25,16.43 170.12,11.3 167.51,11.3 166.88,10.67 R5.1
N$79
  Bottom 0.152: 171.07,12.82 175.09,16.83 213.98,16.83 214,16.81 216.92,16.81 217.64,17.54 217.64,18.8 218.94,20.1 U1.3 | 171.07,12.82 170.88,12.63 | 171.07,12.82 169.94,11.68 163.96,11.68 163.07,10.79 R4.1
N$80
  Bottom 0.152: 170.79,13.1 174.92,17.23 214.01,17.23 214.12,17.12 216.66,17.12 217.24,17.7 217.24,18.83 218.91,20.5 U1.4 | 170.79,13.1 170.6,12.91 | 170.79,13.1 169.75,12.06 161.23,12.06 R79.1
N$81
  Bottom 0.152: 170.51,13.39 174.76,17.63 214.04,17.63 214.25,17.42 216.4,17.42 216.84,17.87 216.84,19.19 216.96,19.3 217.26,19.3 218.03,20.07 218.05,20.07 218.88,20.9 U1.5 | 170.51,13.39 170.32,13.2 | 170.51,13.39 169.57,12.45 157.1,12.45 155.45,10.79 R78.1
N$82
  Bottom 0.152: U1.6 218.4,21.3 218.26,21.16 218.26,20.71 217.92,20.37 217.9,20.37 217.14,19.61 216.76,19.61 216.46,19.3 216.46,18.67 215.52,17.73 214.38,17.73 214.07,18.03 174.59,18.03 169.38,12.83 153.92,12.83 151.64,10.54 R77.1
N$84  (via drill 0.35)
  Top 0.305: v295.15,8.76 295.68,9.29 LED617.C LED618.C LED619.C LED620.C LED621.C LED622.C LED623.C LED624.C
  Bottom 0.305: v295.15,8.76 295.85,8.76 R22.2
N$85  (via drill 0.35)
  Top 0.305: v291.34,8.76 291.87,9.29 LED609.C 291.87,13.72 | LED616.C LED615.C LED614.C LED613.C LED612.C LED611.C 291.87,13.72 | 291.87,13.72 LED610.C
  Bottom 0.305: v291.34,8.76 292.04,8.76 R1.2
N$86  (via drill 0.35)
  Top 0.305: v287.53,8.76 288.06,9.29 LED601.C LED602.C LED603.C LED604.C LED605.C LED606.C LED607.C LED608.C
  Bottom 0.305: R2.2 288.23,8.76 v287.53,8.76
N$87  (via drill 0.35)
  Top 0.305: v283.72,8.76 284.25,9.29 LED593.C LED594.C LED595.C LED596.C LED597.C LED598.C LED599.C LED600.C
  Bottom 0.305: R3.2 284.42,8.76 v283.72,8.76
N$88  (via drill 0.35)
  Top 0.305: v279.91,8.76 280.44,9.29 LED585.C 280.44,13.21 | 280.44,13.21 280.44,17.02 | 280.44,17.02 280.44,20.83 | 280.44,20.83 280.44,24.64 | 280.44,24.64 280.44,28.45 | 280.44,28.45 280.44,32.26 | 280.44,32.26 LED592.C | LED586.C 280.44,13.21 | LED587.C 280.44,17.02 | LED588.C 280.44,20.83 | LED589.C 280.44,24.64 | LED590.C 280.44,28.45 | LED591.C 280.44,32.26
  Bottom 0.305: R23.2 280.61,8.76 v279.91,8.76
N$89  (via drill 0.35)
  Top 0.305: v276.1,8.76 276.63,9.29 LED577.C 276.63,13.21 | LED584.C 276.63,32.26 | 276.63,32.26 276.63,29.72 | 276.63,29.72 276.63,25.91 | 276.63,25.91 276.63,20.83 | 276.63,20.83 276.63,17.02 | 276.63,17.02 276.63,13.21 | LED583.C 276.63,32.26 | LED582.C 276.63,29.72 | LED581.C 276.63,25.91 | LED580.C 276.63,20.83 | LED579.C 276.63,17.02 | LED578.C 276.63,13.21
  Bottom 0.305: R24.2 276.8,8.76 v276.1,8.76
N$90  (via drill 0.35)
  Top 0.305: v272.29,8.76 272.82,9.29 LED569.C 272.82,14.48 | 272.82,14.48 272.82,18.29 | 272.82,18.29 272.82,22.1 | 272.82,22.1 272.82,25.91 | 272.82,25.91 272.82,28.45 | 272.82,28.45 272.82,32.26 | 272.82,32.26 LED576.C | LED570.C 272.82,14.48 | LED571.C 272.82,18.29 | LED572.C 272.82,22.1 | LED573.C 272.82,25.91 | LED574.C 272.82,28.45 | LED575.C 272.82,32.26
  Bottom 0.305: R25.2 272.99,8.76 v272.29,8.76
N$91  (via drill 0.35)
  Top 0.305: v268.48,8.76 269.01,9.29 LED561.C 269.01,13.21 | LED568.C 269.01,32.26 | 269.01,32.26 269.01,28.45 | 269.01,28.45 269.01,24.64 | 269.01,24.64 269.01,20.83 | 269.01,20.83 269.01,17.02 | 269.01,17.02 269.01,13.21 | LED567.C 269.01,32.26 | LED566.C 269.01,28.45 | LED565.C 269.01,24.64 | 269.01,20.83 LED564.C 269.01,17.02 | LED563.C 269.01,17.02 | LED562.C 269.01,13.21
  Bottom 0.305: R26.2 269.18,8.76 v268.48,8.76
N$92  (via drill 0.35)
  Top 0.152: LED560.C LED559.C LED558.C LED557.C LED556.C LED555.C LED554.C LED553.C
  Top 0.305: LED553.C 265.2,9.29 v264.67,8.76
  Bottom 0.305: R27.2 265.37,8.76 v264.67,8.76